# EAGLE design cc2538-multi-connect (EAGLE 7.7.0)
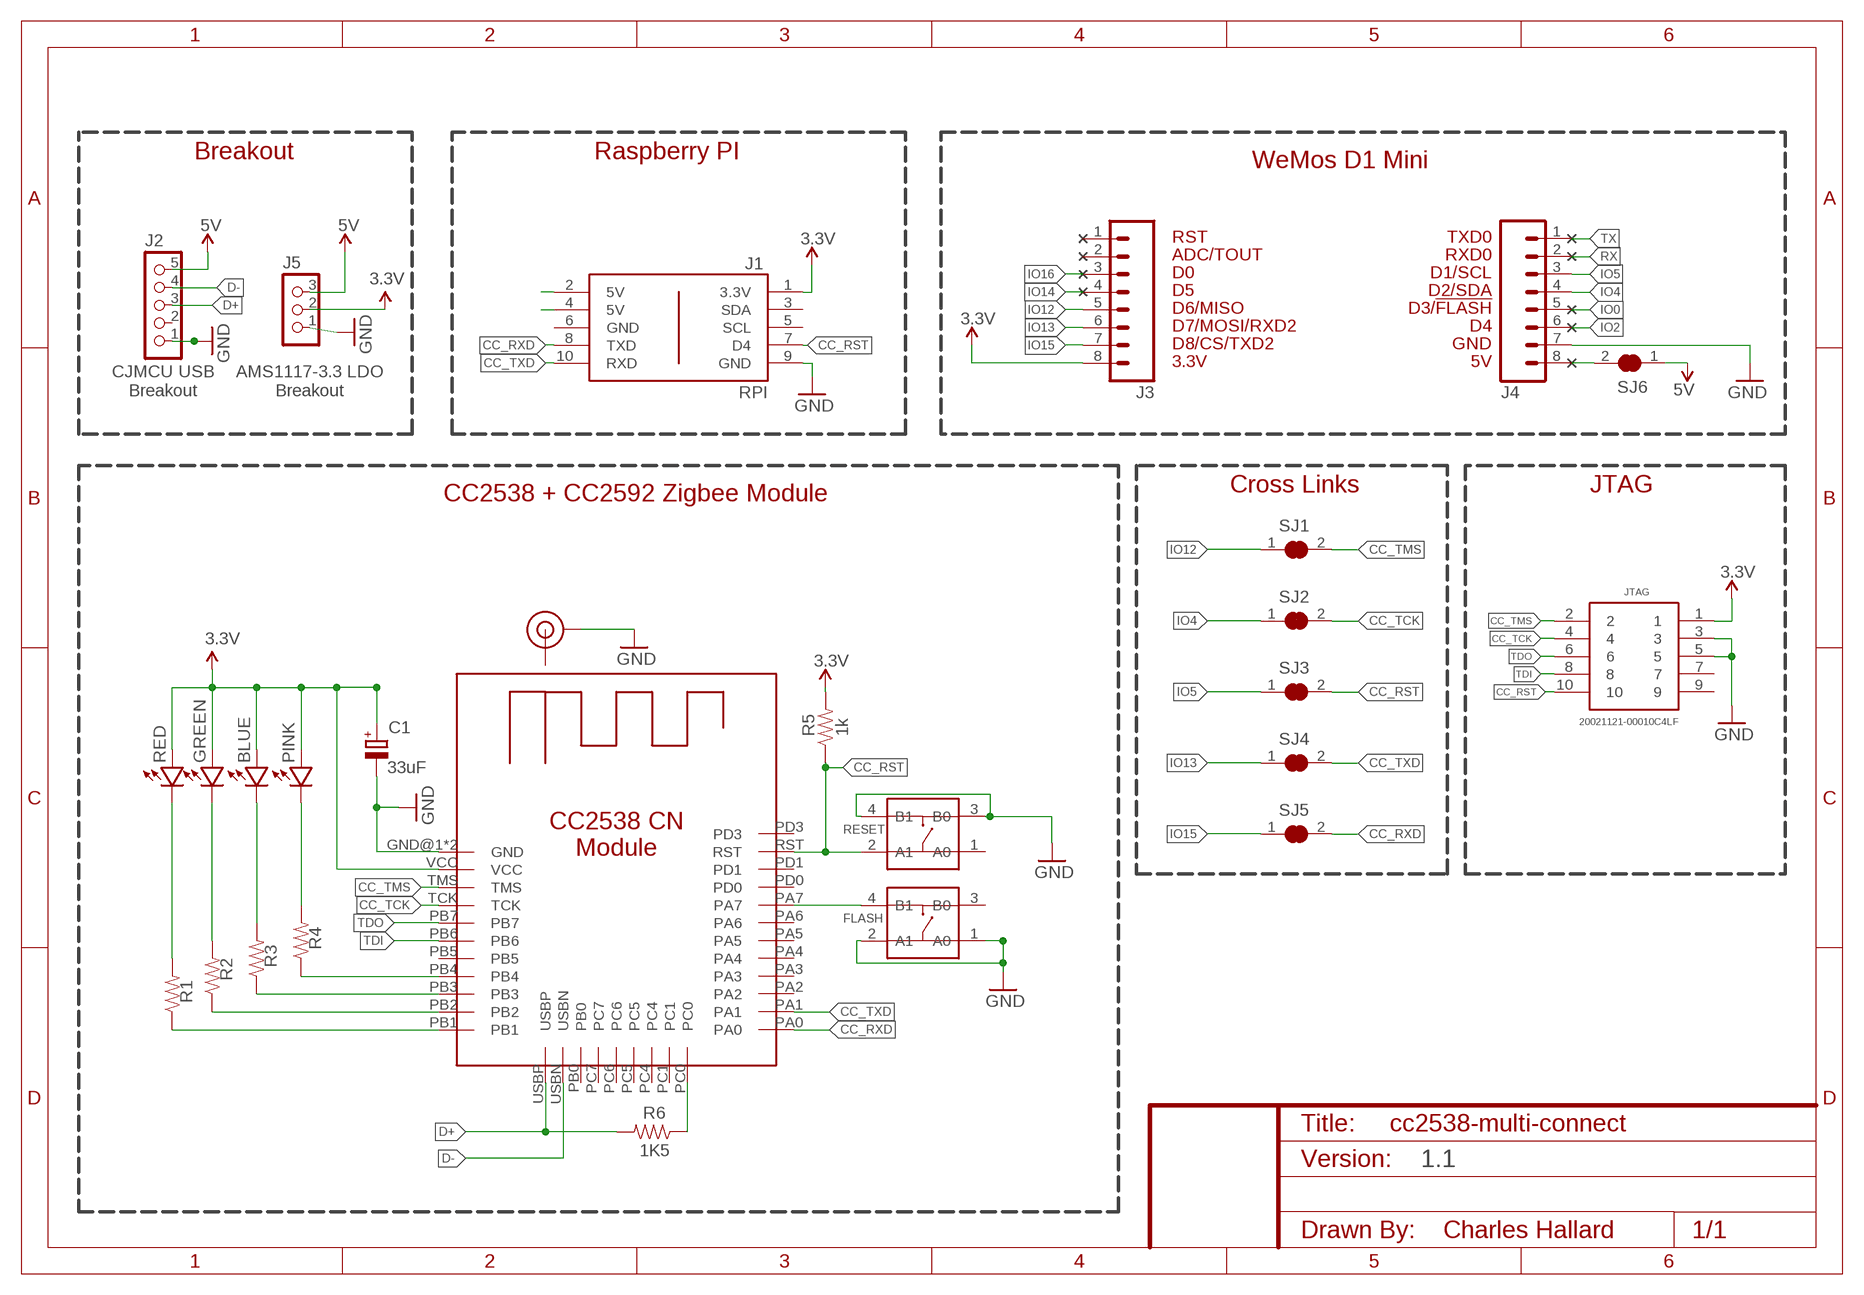
[diagram p0: schematic, sheet 1]
FRAME1 (FRAME-A4): AUTHOR: Charles Hallard; VERSION: 1.1

## Parts
BLUE  Led  LED0805-LARGE  [0805-LED-LARGEPADS]
C1  33uF  CPOL-EUA/3216-18W  [A/3216-18W]
FLASH  BOOT  SMD-BUTTON-TOP-DHT-4235A(4P-4.2X3.2MM)  [SW4-SMD-4.2X3.2X2.5MM]
GREEN  Led  LED0805-LARGE  [0805-LED-LARGEPADS]
J1  RPI  REMORA-IO-MINSTD  [2X05]
J2  CON_HEADER_1X05-PTH  [M1X5]
J3  M08  [1X08]
J4  M08  [1X08]
J5  CON_HEADER_1X03-PTH  [M1X3]
J$2  ANTENNAEDGE  [SMA-EDGE]
JTAG  20021121-00010C4LF  [2002112100010C4LF]
PINK  Led  LED0805-LARGE  [0805-LED-LARGEPADS]
R1  RESISTOR0805-RES  [0805-RES]
R2  RESISTOR0805-RES  [0805-RES]
R3  RESISTOR0805-RES  [0805-RES]
R4  RESISTOR0805-RES  [0805-RES]
R5  1k  RESISTOR0805-RES  [0805-RES]
R6  1K5  RESISTOR0805-RES  [0805-RES]
RED  Led  LED0805-LARGE  [0805-LED-LARGEPADS]
RESET  BOOT  SMD-BUTTON-TOP-DHT-4235A(4P-4.2X3.2MM)  [SW4-SMD-4.2X3.2X2.5MM]
SJ1  D6/P2_1_DD  SJC-NORMAL  [SJC]
SJ2  D2/P2_2_DC  SJC-NORMAL  [SJC]
SJ3  D1/CC_RST  SJC-NORMAL  [SJC]
SJ4  D7/P0_3  SJC-NORMAL  [SJC]
SJ5  D8/P0_2  SJC-NORMAL  [SJC]
SJ6  D6/P2_1_DD  SJC-NORMAL  [SJC]
U$27  CC2538-CN  [CC2538-CN]

## Nets
3.3V: BLUE.PLUS C1.+ GREEN.PLUS J1.1(3.3V) J3.8 J5.2 JTAG.1 PINK.PLUS R5.2 RED.PLUS U$27.VCC
5V: J2.5 J5.3 SJ6.1
5V1: J1.2(5V)
5V2: J1.4(5V)
5VD1: J4.8 SJ6.2
CC_RST: J1.7(D4) JTAG.10 R5.1 RESET.2(A1) SJ3.2 U$27.RST
CC_RXD: J1.8(TXD) SJ5.2 U$27.PA0
CC_TCK: JTAG.4 SJ2.2 U$27.TCK
CC_TMS: JTAG.2 SJ1.2 U$27.TMS
CC_TXD: J1.10(RXD) SJ4.2 U$27.PA1
D+: J2.3 R6.2 U$27.USBP
D-: J2.4 U$27.USBN
FLASH: FLASH.4(B1) U$27.PA7
GND: C1.- FLASH.1(A0) FLASH.2(A1) J1.9(GND) J2.1 J4.7 J5.1 J$2.GND@1(GND) J$2.GND@2(GND) J$2.GND@3(GND) JTAG.3 JTAG.5 RESET.3(B0) RESET.4(B1) U$27.GND@1(GND) U$27.GND@2(GND)
IO0: J4.5
IO2: J4.6
IO4: J4.4 SJ2.1
IO5: J4.3 SJ3.1
IO12: J3.5 SJ1.1
IO13: J3.6 SJ4.1
IO14: J3.4
IO15: J3.7 SJ5.1
IO16: J3.3
N$1: BLUE.MINUS R3.2
N$2: R1.1 U$27.PB1
N$3: R2.1 U$27.PB2
N$4: R3.1 U$27.PB3
N$5: R4.1 U$27.PB4
N$6: PINK.MINUS R4.2
N$7: GREEN.MINUS R2.2
N$8: R1.2 RED.MINUS
N$9: R6.1 U$27.PC0
RX: J4.2
TDI: JTAG.8 U$27.PB6
TDO: JTAG.6 U$27.PB7
TX: J4.1
Unconnected: FLASH.3(B0) J1.3(SDA) J1.5(SCL) J1.6(GND) J2.2 J3.1 J3.2 J$2.GND@0(ANT) J$2.SIG(ANT) JTAG.7 JTAG.9 RESET.1(A0) U$27.PA2 U$27.PA3 U$27.PA4 U$27.PA5 U$27.PA6 U$27.PB0 U$27.PB5 U$27.PC1 U$27.PC4 U$27.PC5 U$27.PC6 U$27.PC7 U$27.PD0 U$27.PD1 U$27.PD3

## Notes on the sheet
- Breakout | Raspberry PI
- WeMos D1 Mini
- RST | TXD0
- ADC/TOUT | RXD0
- D0 | D1/SCL
- D5 | D2/SDA
- D6/MISO | D3/!FLASH
- D7/MOSI/RXD2 | D4
- D8/CS/TXD2 | GND
- 3.3V | 5V
- CJMCU USB
  Breakout
- AMS1117-3.3 LDO
  Breakout
- Cross Links | JTAG
- CC2538 + CC2592 Zigbee Module

## Library data of the parts
BLUE GREEN PINK RED = _c2h:LED
C1 = rcl:CPOL-EU: POLARIZED CAPACITOR, European symbol; SPICEPREFIX: C
FLASH RESET = Seeed-Switch:SMD-BUTTON-TOP-DHT-4235A(4P-4.2X3.2MM): 311020045; MPN: DHT-4235A; VALUE: DHT-4235A
J1 = _c2h:REMORA-IO-MIN
J2 = dp_devices:CON_HEADER_1X05
J3 J4 = freetronics-original:M08: Header 8 Standard 8-pin 0.1" header. Use with straight break away headers (SKU : PRT-00116), right angle break away headers (PRT-00553), swiss pins (PRT-00743), machine pins (PRT-00117), and female headers (PRT-00115).
J5 = dp_devices:CON_HEADER_1X03
J$2 = _c2h:ANTENNA: SMA Antenna Connector End launch SMA connector. The paste layer has been removed so that the connector can be hand soldered onto the board after reflow.
JTAG = 20021121-00010C4LF:20021121-00010C4LF: Headers & Wire Housings 1.27x1.27mm BTB, Hdr Unshrd, SMT, 10 Pos Source: Datasheet; DESCRIPTION: Headers & Wire Housings 1.27x1.27mm BTB, Hdr Unshrd, SMT, 10 Pos; HEIGHT: 4.55mm; MANUFACTURER_NAME: Amphenol; MANUFACTURER_PART_NUMBER: 20021121-00010C4LF; MOUSER_PART_NUMBER: 649-202112100010C4LF; MOUSER_PRICE-STOCK: https://www.mouser.com/Search/Refine.aspx?Keyword=649-202112100010C4LF
R1-R6 = _c2h:RESISTOR: Resistor Basic schematic elements and footprints for 0603, 1206, and PTH resistors.
SJ1-SJ6 = SuperHouse-Jumpers:SJC: Solder jumper. Normally closed: does not need solder to close. Can be opened by cutting the track.
U$27 = codm:CC2538-CN: CC2538 + CC2592 typical Chinese Module black/green Credits 3D Model, take from uzsito's KiCad Component: https://github.com/uzsito/CC2538-CC2592-kicad-component

## Net classes
0 default: width 0.203 mm, drill 0.356 mm, clearance 0.152 mm
1 power: width 0.203 mm, clearance 0.152 mm

## Board
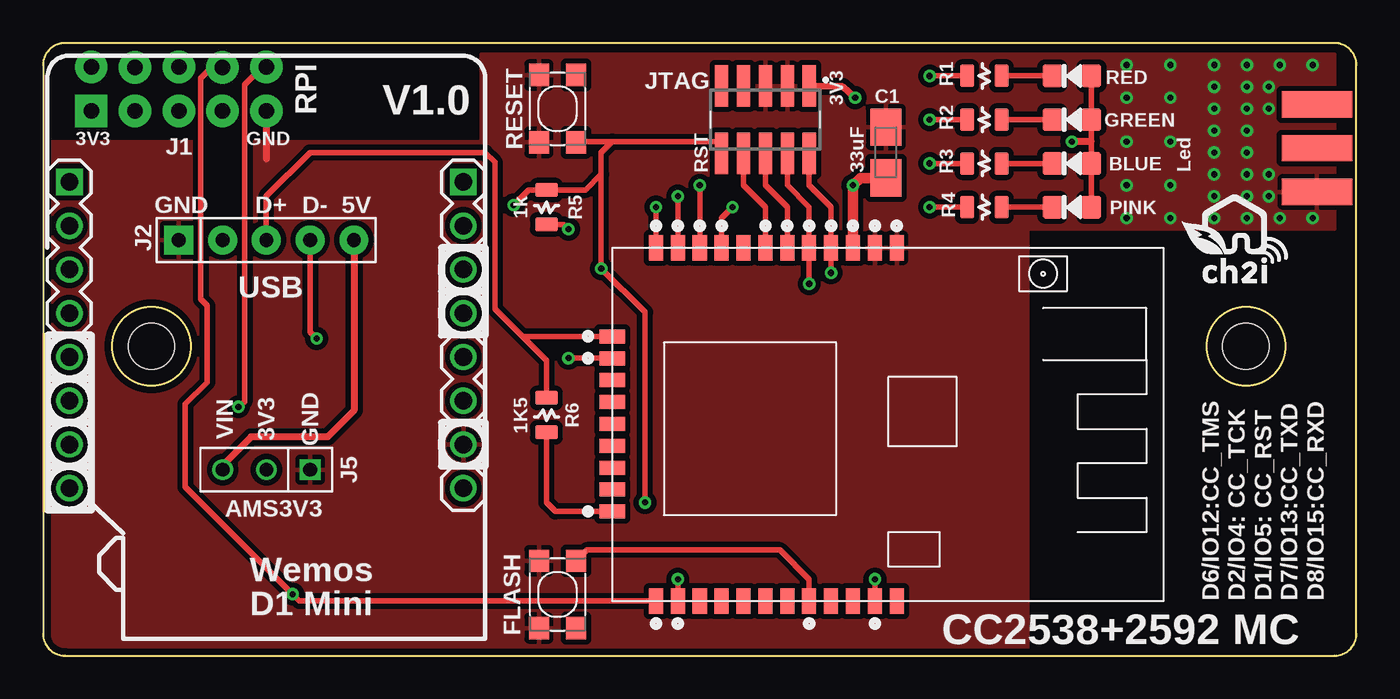
[diagram p1: board, top side]
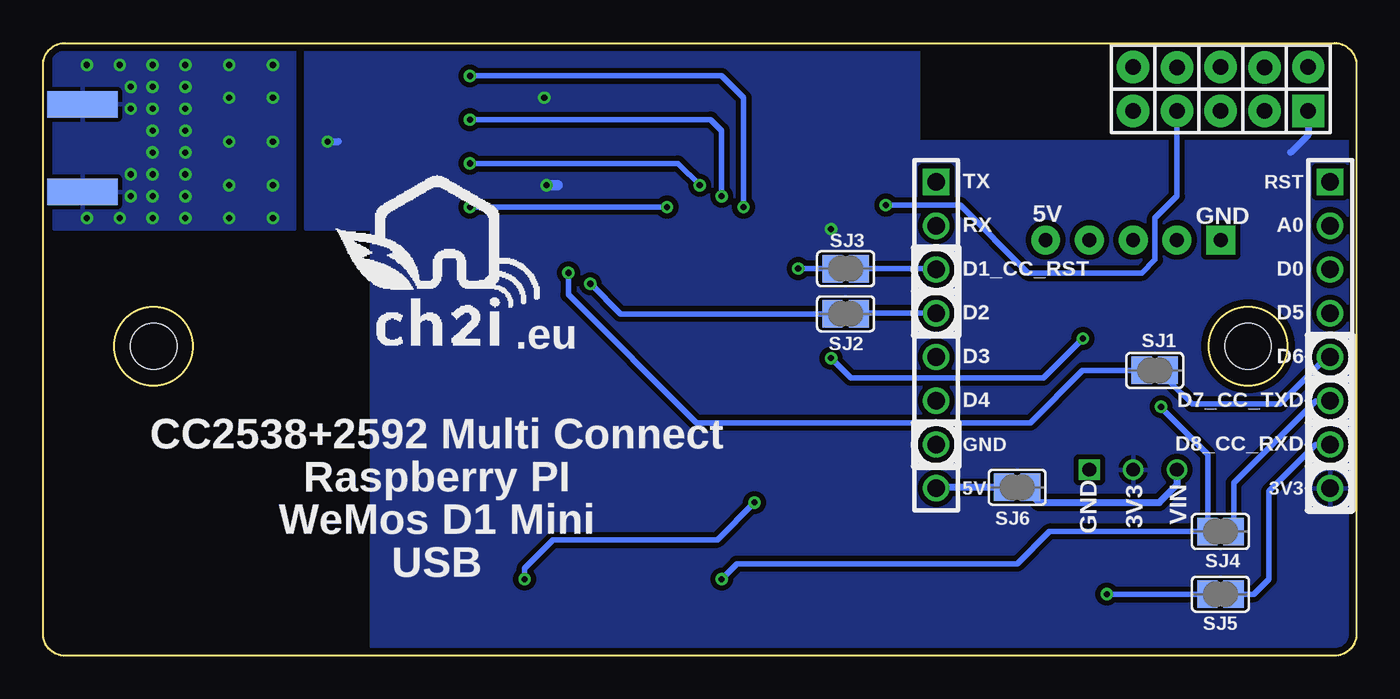
[diagram p2: board, bottom side, seen from below]

Size 76.2 x 35.56 mm. Coordinates in mm from the lower left corner, seen from the top.
Outline: 1.27,35.56 arc90 0,34.29 0,1.27 arc90 1.27,0 74.93,0 arc90 76.2,1.27 76.2,34.29 arc90 74.93,35.56 1.27,35.56
Outline: circle at 69.79,17.97 radius 2.29
Outline: circle at 6.29,17.97 radius 2.29
Copper layers (1*16): Top 0.035559375mm / dielectric 1.6mm / Bottom 0.035559375mm
Design rules "oshpark-2layer-tented": minimum track width 6mil, minimum drill 10mil, track to track 6mil, track to pad 6mil, pad to pad 6mil, via to via 6mil, smd to smd 6mil, copper to edge 15mil, drill to drill 6mil, minimum pad ring 5mil, minimum via ring 5mil, stop-mask expansion 2.5mil, vias tented up to drill 20mil, thermal gap 10mil
Holes 2.67 mm at 69.79,17.97 6.29,17.97

### Footprints (pad centres in the part's own frame; a part is rotated, then mirrored left to right if it is on the bottom)
0805-LED-LARGEPADS = smd 1.156 x 1.3: MINUS -1.127,0; PLUS 1.127,0
A/3216-18W = smd 2.15 x 1.8: + 1.475,0; - -1.475,0
SW4-SMD-4.2X3.2X2.5MM = smd 1.3 x 1.15: 1 -1.95,1.075; 2 1.95,1.075; 3 -1.95,-1.075; 4 1.95,-1.075
2X05 = drill 0.9 pad 1.88 square: 1 -5.08,-1.264 | drill 0.9 pad 1.88: 2 -5.08,1.276; 3 -2.54,-1.276; 4 -2.54,1.264; 5 0,-1.264; 6 0,1.276; 7 2.54,-1.276; 8 2.54,1.264; 9 5.08,-1.264; 10 5.08,1.276
M1X5 = drill 0.8 pad 1.676 square: 1 -5.08,0 | drill 0.8 pad 1.676: 2 -2.54,0; 3 0,0; 4 2.54,0; 5 5.08,0
1X08 = drill 1.016 square: 1 0,0 | drill 1.016: 2 2.54,0; 3 5.08,0; 4 7.62,0; 5 10.16,0; 6 12.7,0; 7 15.24,0; 8 17.78,0
M1X3 = drill 0.8 square: 1 0,0 | drill 0.8: 2 2.54,0; 3 5.08,0
SMA-EDGE = smd 1.524 x 4.064: GND@0 0,0; GND@1 5.08,0; SIG 2.54,0 | smd 1.524 x 4.064 bottom: GND@2 0,0; GND@3 5.08,0
2002112100010C4LF = smd 0.76 x 2.4: 1 -2.54,-1.95; 2 -2.54,1.95; 3 -1.27,-1.95; 4 -1.27,1.95; 5 0,-1.95; 6 0,1.95; 7 1.27,-1.95; 8 1.27,1.95; 9 2.54,-1.95; 10 2.54,1.95
0805-RES = smd 0.8 x 1.3: 1 -1,0; 2 1,0
SJC = smd 1.168 x 1.6: 1 -0.762,0; 2 0.762,0
CC2538-CN = smd 0.813 x 1.473: GND@1 16.51,20.5; GND@2 15.24,20.5; PA0 2.54,0; PA1 3.81,0; PA2 5.08,0; PA3 6.35,0; PA4 7.62,0; PA5 8.89,0; PA6 10.16,0; PA7 11.43,0; PB1 2.54,20.5; PB2 3.81,20.5; PB3 5.08,20.5; PB4 6.35,20.5; PB5 7.62,20.5; PB6 8.89,20.5; PB7 10.16,20.5; PD0 12.7,0; PD1 13.97,0; PD3 16.51,0; RST 15.24,0; TCK 11.43,20.5; TMS 12.7,20.5; VCC 13.97,20.5 | smd 1.473 x 0.813: PB0 0,12.82; PC0 0,5.2; PC1 0,6.47; PC4 0,7.74; PC5 0,9.01; PC6 0,10.28; PC7 0,11.55; USBN 0,14.09; USBP 0,15.36

### Placement (x,y rotation side)
BLUE  59.69,28.58 0 top
C1  48.9,29.21 270 top
FLASH  29.84,3.56 90 top
GREEN  59.69,31.12 0 top
J1  7.87,32.89 0 top
J2  12.95,24.13 0 top
J3  1.52,27.5 270 top
J4  24.38,27.5 270 top
J5  15.49,10.79 180 top
J$2  73.91,32 270 top
JTAG  41.91,31.12 180 top
PINK  59.69,26.03 0 top
R1  54.61,33.66 0 top
R2  54.61,31.12 0 top
R3  54.61,28.58 0 top
R4  54.61,26.03 0 top
R5  29.21,26.03 270 top
R6  29.21,13.97 90 top
RED  59.69,33.66 0 top
RESET  29.84,31.75 270 top
SJ1  11.7,16.56 180 bottom
SJ2  29.63,19.85 180 bottom
SJ3  29.63,22.46 180 bottom
SJ4  7.89,7.21 180 bottom
SJ5  7.89,3.57 180 bottom
SJ6  19.68,9.78 180 bottom
U$8  [LOGO_C2I_015]  66.04,21.59 0 top
U$9  [LOGO_CH2I_110MM]  52.7,20.95 0 bottom
U$27  33.02,3.17 0 top

### Tracks (layer width: path | path; a pad name or v marks a point on that pad's centre or on a via)
3.3V  (via drill 0.36 pad 0.71)
  Top 0.305: RED.PLUS GREEN.PLUS 60.82,29.84 BLUE.PLUS PINK.PLUS | R5.2 30.21,25.03 v30.48,24.77
  Top 0.406: v47.12,32.38 46.4,33.02 JTAG.1 | 60.82,29.84 v59.69,29.84
  Top 0.61: C1.+ 47.42,27.73 v46.99,27.3 U$27.VCC
  Bottom 0.406: J1.1 2.79,30.23 3.81,29.21 | v59.69,29.84 59.05,29.84
  Bottom 0.61: v46.99,27.3 46.35,27.3
  pour Bottom (isolate 0.305): -1.27,-0.63 57.15,-0.63 57.15,24.77 60.96,24.77 60.96,35.56 25.4,35.56 25.4,29.84 -1.27,29.84
5V
  Top 0.406: J2.5 18.03,14.22 16.51,12.7 12.07,12.7 10.41,11.05 J5.3
  Bottom 0.406: SJ6.1 18.92,9.4 18.41,8.89 11.43,8.89 10.41,9.91 J5.3
5VD1
  Bottom 0.406: SJ6.2 24.32,9.78 J4.8
CC_RST  (via drill 0.36 pad 0.71)
  Top 0.305: U$27.RST v48.26,4.45 | v34.92,8.89 34.92,19.94 v32.38,22.48 32.38,27.94 | 39.33,29.16 JTAG.10 39.33,29.84 33.02,29.84 | v27.3,26.16 28.18,27.03 R5.1 31.48,27.03 32.38,27.94 | 33.02,29.84 31.12,29.84 31.07,29.8 RESET.2 | 32.38,27.94 32.38,29.21 33.02,29.84
  Bottom 0.305: v48.26,4.45 48.26,5.08 46.61,6.73 37.08,6.73 v34.92,8.89 | SJ3.2 32.37,22.46 v32.38,22.48 | v27.3,26.16 22.99,26.16 19.05,22.22 12.45,22.22 11.68,22.99 11.68,25.4 10.41,26.67 J1.7
CC_RXD  (via drill 0.36 pad 0.71)
  Top 0.305: U$27.PA0 14.86,3.17 14.46,3.57 v14.48,3.57 8.25,9.8 8.25,14.61 9.53,15.88 9.53,20.32 9.14,20.7 9.14,33.53 9.77,34.16 J1.8
  Bottom 0.305: v14.48,3.57 SJ5.2
CC_TCK  (via drill 0.36 pad 0.71)
  Top 0.305: v44.45,21.59 U$27.TCK 44.45,26.03 43.18,27.3 JTAG.4
  Bottom 0.305: v44.45,21.59 42.71,19.85 SJ2.2
CC_TMS  (via drill 0.36 pad 0.71)
  Top 0.305: v45.72,22.22 U$27.TMS 45.72,26.03 44.45,27.3 JTAG.2
  Bottom 0.305: v45.72,22.22 45.72,20.95 38.29,13.53 18.92,13.53 15.89,16.56 SJ1.2
CC_TXD  (via drill 0.36 pad 0.71)
  Top 0.305: v36.83,4.45 U$27.PA1 | v11.33,14.45 11.68,14.73 11.68,33.15 12.7,34.16 J1.10
  Bottom 0.305: v36.83,4.45 35.94,5.33 19.68,5.33 17.81,7.21 SJ4.2 8.64,7.22 8.64,11.68 11.33,14.38 v11.33,14.45
D+
  Top 0.305: J2.3 12.95,26.67 15.49,29.21 25.65,29.21 26.22,28.64 26.22,20.14 27.82,18.54 | R6.2 29.21,17.14 27.82,18.54 | U$27.USBP 27.82,18.54
D-  (via drill 0.36 pad 0.71)
  Top 0.305: J2.4 15.49,18.8 v15.88,18.41 | v30.48,17.27 33.01,17.27 U$27.USBN
  Bottom 0.305: v15.88,18.41 18.16,16.13 29.34,16.13 v30.48,17.27
FLASH
  Top 0.305: U$27.PA7 44.45,4.45 42.75,6.14 31.55,6.14 FLASH.4
GND  (via drill 0.36 pad 0.71)
  Top 0.406: J1.9 12.95,28.83
  other vias: 73.66,34.29 71.75,34.29 69.85,34.29 69.85,33.02 69.85,31.75 69.85,30.48 69.85,29.21 69.85,27.94 69.85,26.67 69.85,25.4 71.75,25.4 73.66,25.4 67.94,34.29 67.94,33.02 67.94,31.75 67.94,30.48 67.94,29.21 67.94,27.94 67.94,26.67 67.94,25.4 71.12,31.75 71.12,33.02 71.12,26.67 71.12,27.94 62.87,34.29 62.87,25.4 62.87,29.84 62.87,32.38 62.87,27.3 65.41,27.3 65.41,29.84 65.41,32.38 65.41,25.4 65.41,34.29
  pour Top (isolate 0.305): -0.64,0 57.15,0 57.15,24.77 74.93,24.77 74.93,34.92 25.4,34.92 25.4,29.84 -0.64,29.84
  pour Bottom (isolate 0.305): 61.6,35.56 61.6,24.77 75.56,24.77 75.56,35.56
IO4
  Bottom 0.305: J4.4 28.84,19.88 SJ2.1
IO5
  Bottom 0.305: 24.43,22.46 J4.3 | SJ3.1 24.43,22.46 | 24.34,22.46 24.43,22.46
IO12
  Bottom 0.305: SJ1.1 10.84,15.93 9.53,14.61 4.45,14.61 1.71,17.34 J3.5
IO13
  Bottom 0.305: SJ4.1 7.13,10.02 2.34,14.8 J3.6
IO15
  Bottom 0.305: J3.7 2.34,12.26 5.08,9.52 5.08,4.45 5.95,3.57 SJ5.1
N$1
  Top 0.305: BLUE.MINUS R3.2
N$2  (via drill 0.36 pad 0.71)
  Top 0.305: R1.1 v51.44,33.66 | v35.56,26.03 U$27.PB1
  Bottom 0.305: v51.44,33.66 36.83,33.66 35.56,32.38 v35.56,26.03
N$3  (via drill 0.36 pad 0.71)
  Top 0.305: U$27.PB2 v36.83,26.67 | R2.1 v51.44,31.12
  Bottom 0.305: v51.44,31.12 37.46,31.12 36.83,30.48 v36.83,26.67
N$4  (via drill 0.36 pad 0.71)
  Top 0.305: R3.1 v51.44,28.58 | v38.1,27.3 U$27.PB3
  Bottom 0.305: v51.44,28.58 39.37,28.58 v38.1,27.3
N$5  (via drill 0.36 pad 0.71)
  Top 0.305: U$27.PB4 39.37,25.4 v40.01,26.03 | v51.44,26.03 R4.1
  Bottom 0.305: v40.01,26.03 v51.44,26.03
N$6
  Top 0.305: PINK.MINUS R4.2
N$7
  Top 0.305: GREEN.MINUS R2.2
N$8
  Top 0.305: RED.MINUS R1.2
N$9
  Top 0.305: U$27.PC0 29.73,8.38 29.21,8.89 R6.1
TDI
  Top 0.305: JTAG.8 40.64,27.3 41.91,26.03 U$27.PB6
TDO
  Top 0.305: JTAG.6 41.91,27.3 43.18,26.03 U$27.PB7

### Text on the board
tPlace: 3V3 | V1.0 | 3V3 | GND | RST | GND | D+ | D- | 5V | USB | VIN | 3V3 | GND | AMS3V3 | Wemos / D1 Mini | D6/IO12:CC_TMS / D2/IO4: CC_TCK / D1/IO5: CC_RST / D7/IO13:CC_TXD / D8/IO15:CC_RXD | CC2538+2592 MC
bPlace: RST | TX | GND | 5V | A0 | RX | D0 | D1_CC_RST | D5 | D2 | .eu | D6 | D3 | D7_CC_TXD | D4 | D8_CC_RXD | GND | 3V3 | VIN | 3V3 | GND | 5V | CC2538+2592 Multi Connect / Raspberry PI / WeMos D1 Mini / USB